# Altium schematic sheet Triac.SchDoc
size A1; SheetNumber: 5; SheetTotal: 5
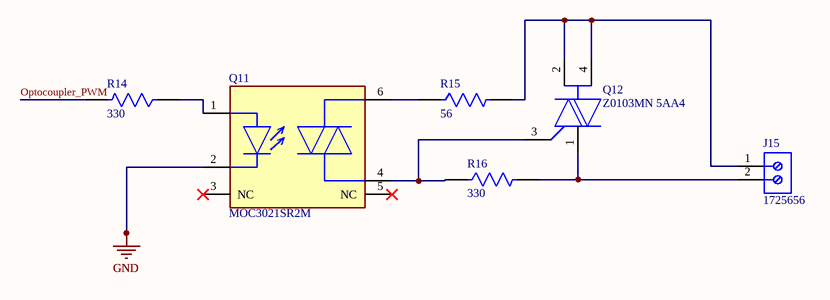
[diagram p0: Triac.SchDoc]

## Parts
J15  1725656  [PHOE-1725656-2]
Q11  MOC3021SR2M  [FP-646BY-MFG]
Q12  Z0103MN 5AA4  [FP-SOT-223-MFG]
R14  Resistance: 330  [FP-MCA1206-IPC_B]  (hidden comment: MCA1206MD1002DP500)
R15  Resistance: 56  [FP-MCA1206-IPC_B]  (hidden comment: MCA1206MD1002DP500)
R16  Resistance: 330  [FP-MCA1206-IPC_B]  (hidden comment: MCA1206MD1002DP500)

## Nets
GND: Q11.2(C)
Optocoupler_PWM: R14.2
NetJ15_1: J15.1 Q12.2(A2) Q12.4(A2) R15.2
NetJ15_2: J15.2 Q12.1(A1) R16.2
NetQ11_1: Q11.1(A) R14.1
NetQ11_4: Q11.4(1_MAIN_TERM.) Q12.3(G) R16.1
NetQ11_6: Q11.6(2_MAIN_TERM.) R15.1

Not connected (* = marked no-connect by the designer): Q11 3(NC)* 5(NC)*

## Library data of the parts
J15 = CMP-2000-05299-1: Male Header, Pitch 2.54 mm, 1 x 2 Position, Height 9 mm, Tail Length 3.5 mm; Manufacturer: Phoenix Contact; Number of contacts: 2; Content: 250pc(s); Pitch: 2.54mm; Industrial packaging: Yes; Colour: Green; Manufacturer part No.: 1725656; Type: MPT0,5/2-2,54; Datasheet URL: http://datasheet.octopart.com/1725656-Phoenix-Contact-datasheet-5302866.pdf; Manufacturer URL: http://www.phoenixcontact.com/; Datasheet Version: Apr-08
Q11 = CMP-00278-84330365-1: MOC3021SR2M Triac Driver Output Optocoupler, 6-Pin DIP 400V Random Phase; Manufacturer Lifecycle Status: ACTIVE; Number of Channels: 1; Reverse Breakdown Voltage: 3V; Max Input Current: 60mA; Forward Voltage: 1.15V; Max Power Dissipation: 330mW; Max Input Voltage: 1.5V; Approvals: UL; Isolation Voltage: 5.3kV; Hold Current: 100µA; RoHS: Compliant; Case/Package: SMD/SMT; Number of Elements: 1; Input Current: 60mA; Forward Current: 60mA; Output Voltage: 400V; Schedule B: 8541408000, 8541408000; REACH SVHC: No SVHC; Number of Pins: 6; Max Operating Temperature: 85°C; Weight: 810mg; Power Dissipation: 330mW; Mount: Surface Mount; Lead Free: Lead Free; Nominal Input Voltage: 1.15V; Radiation Hardening: No; Lifecycle Status: Production; NexarPartId: 84330365; Number of Circuits: 1; Min Operating Temperature: -40°C
Q12 = CMP-12193-000012-1: TRIAC SENS GATE 600V 1A SOT223; Element Configuration: Single; Hold Current: 7mA; Max Operating Temperature: 125°C; Case/Package: SOT-223; RoHS Compliant: Yes; Weight: 0.006632oz; Radiation Hardening: No; Termination: SMD/SMT; Max Repetitive Reverse Voltage (Vrrm): 600V; REACH SVHC: No SVHC; Number of Pins: 3; Min Operating Temperature: -40°C; Height: 1.8mm; Series: -; RMS Current (Irms): 1A; Packaging: Tape and Reel; Lead Free: Lead Free; Width: 3.7mm; Mount: Surface Mount; Package Quantity: 1000; Voltage Rating (DC): 600V; Current Rating: 1A; Length: 6.7mm
R14-R16 = CMP-02407-011266-1: Res MC AT Professional Thin Film 1206 10kΩ 0.5% 0.4W ±25ppm/°C Molded Paper T/R; Voltage Rating: 200V; Max Power Dissipation: 400mW; Weight: 0.000325oz; Height: 0.55mm; Case Code (Imperial): 1206; Packaging: Tape and Reel; Series: MCA AT - Professional; Width: 1.6mm; Resistor Type: Thin Film; Tolerance: 0.5%; Max Operating Temperature: 175°C; Termination: SMD/SMT; Min Operating Temperature: -55°C; Temperature Coefficient: 25ppm/°C; Number of Terminations: 2; Length: 3.2mm; RoHS Compliant: Yes; Case Code (Metric): 3216; Case/Package: 1206; Features: Automotive AEC-Q200; Power Rating: 400mW